# Altium schematic sheet 01_Power_Diagram.SchDoc: Power Diagram
size A4; SheetNumber: 2; SheetTotal: 4
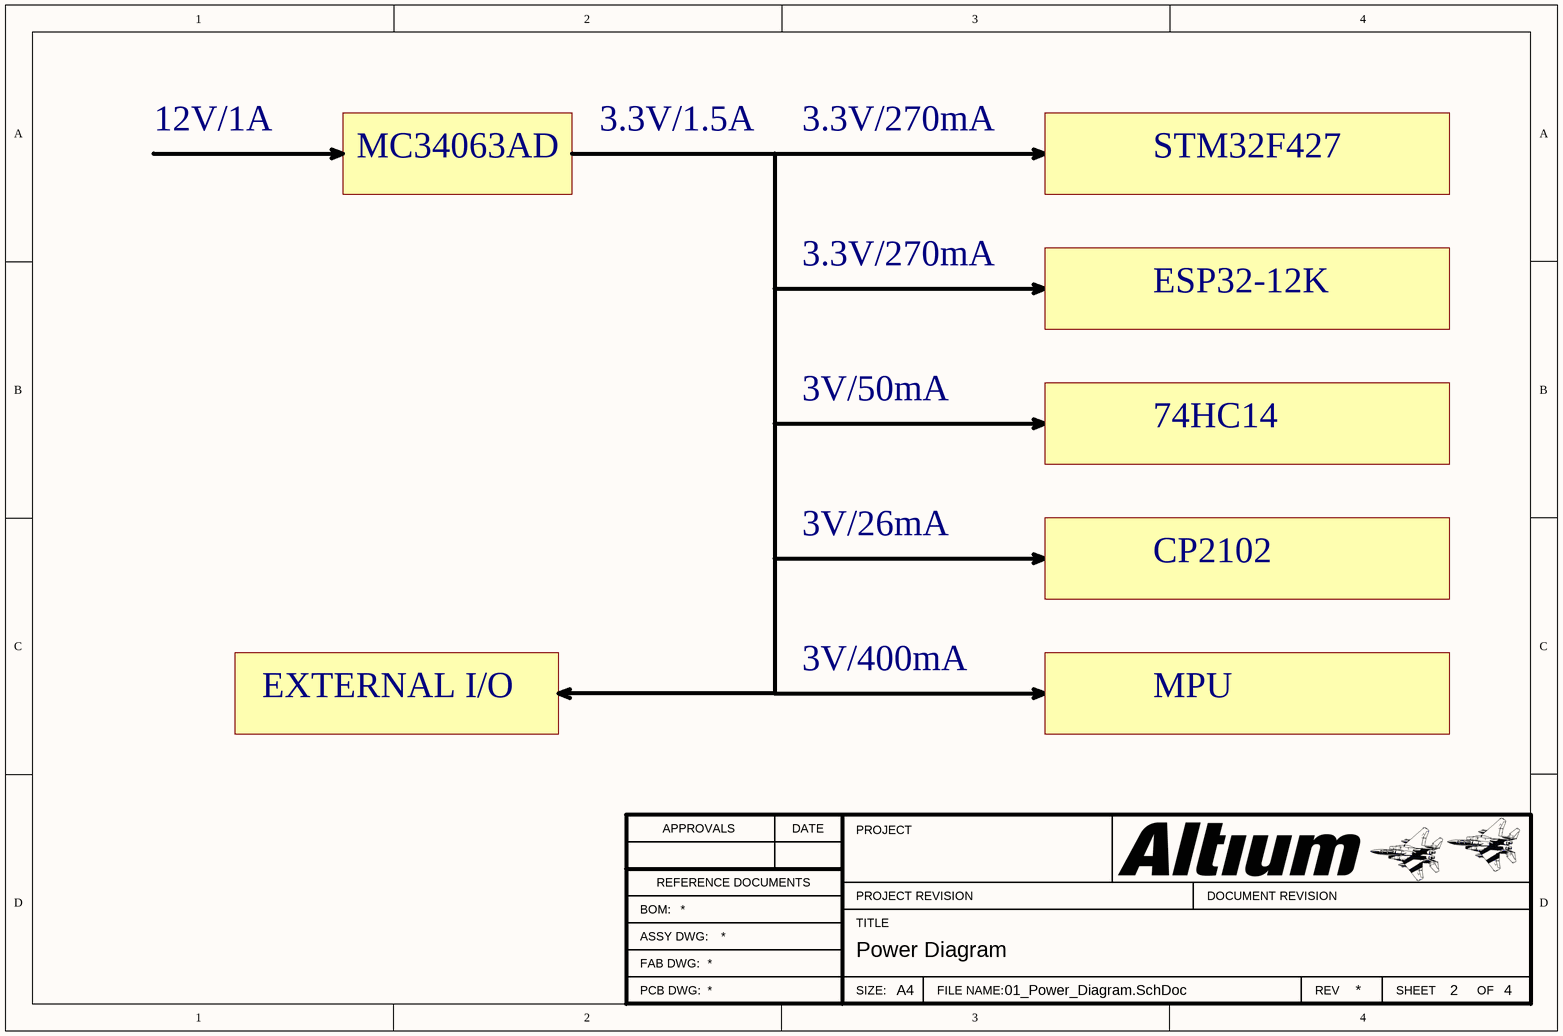
[diagram p0: 01_Power_Diagram.SchDoc]

## Notes on the sheet
- 12V/1A
- MC34063AD
- 3.3V/1.5A
- 3.3V/270mA
- STM32F427
- ESP32-12K
- 3V/50mA
- 74HC14
- 3V/26mA
- CP2102
- EXTERNAL I/O
- 3V/400mA
- MPU
- APPROVALS
- DATE
- PROJECT
- BOM:
- REFERENCE DOCUMENTS
- TITLE
- PROJECT REVISION
- DOCUMENT REVISION
- ASSY DWG:
- FAB DWG:
- PCB DWG:
- SIZE:
- A4
- FILE NAME:
- REV
- SHEET
- OF